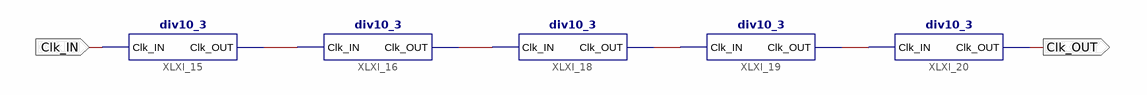
[diagram p0: schematic sheet 1]
// Xilinx ISE schematic Clk.sch (spartan6) as structural Verilog: 5 symbols, 2 ports
module Clk (
  input  Clk_IN,
  output Clk_OUT
);

  wire XLXN_1, XLXN_2, XLXN_3, XLXN_4;

  div10_3 XLXI_15 (.Clk_IN(Clk_IN), .Clk_OUT(XLXN_1));
  div10_3 XLXI_16 (.Clk_IN(XLXN_1), .Clk_OUT(XLXN_2));
  div10_3 XLXI_18 (.Clk_IN(XLXN_2), .Clk_OUT(XLXN_3));
  div10_3 XLXI_19 (.Clk_IN(XLXN_3), .Clk_OUT(XLXN_4));
  div10_3 XLXI_20 (.Clk_IN(XLXN_4), .Clk_OUT(Clk_OUT));
endmodule
